# EAGLE design Driver3 (EAGLE 6.0)
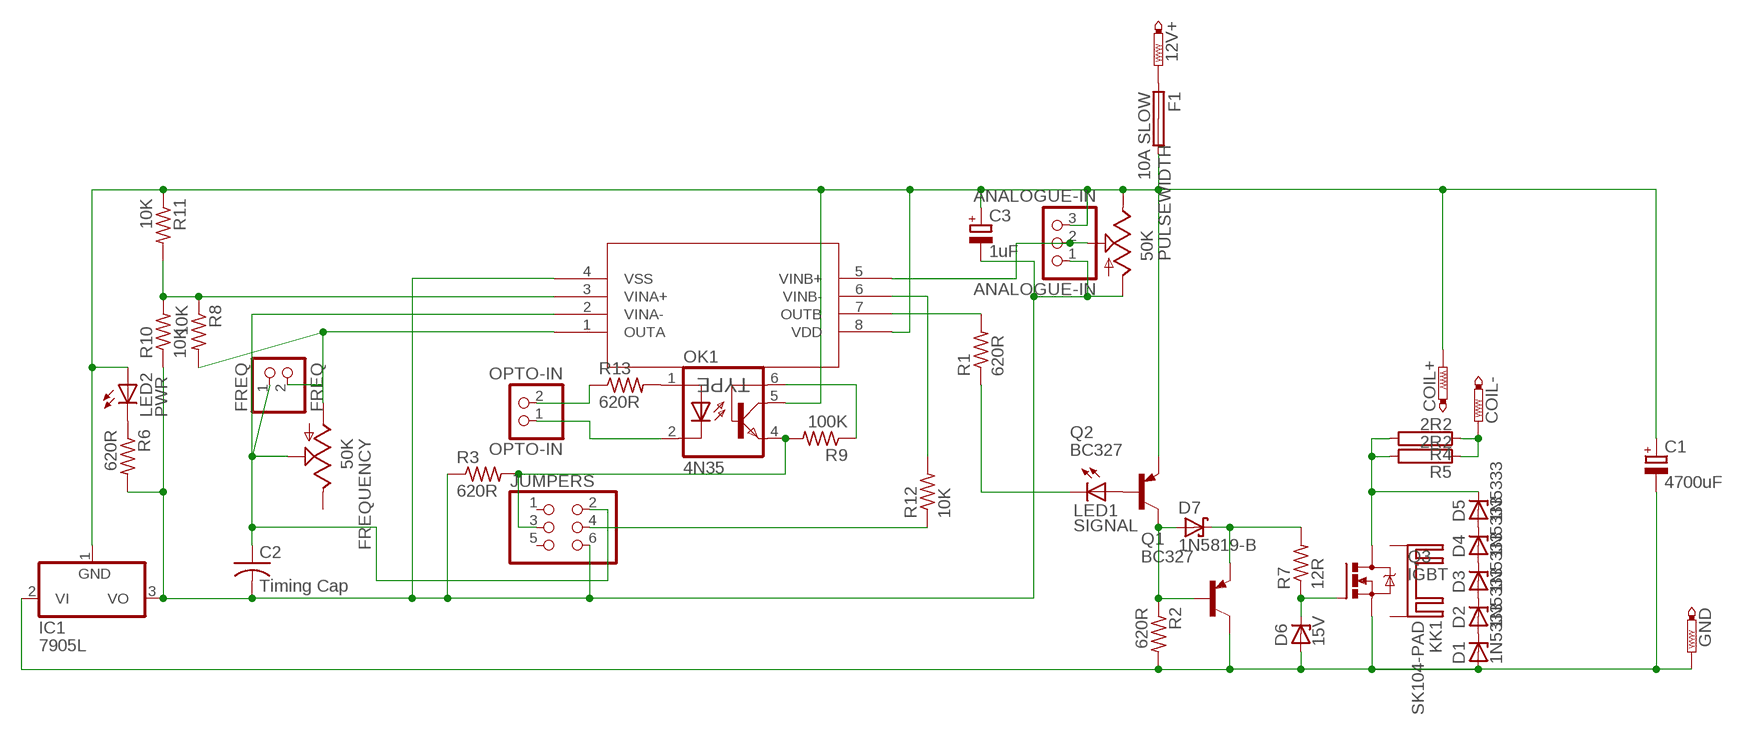
[diagram p0: schematic, sheet 1]

## Parts
12V+  PTR1PAD1-20Y  [P1-20Y]
ANALOGUE-IN  ANALOGUE-IN  PINHD-1X3  [1X03]
C1  4700uF  CPOL-EUE7.5-16  [E7,5-16]
C2  Timing Cap  C-US050-025X075  [C050-025X075]
C3  1uF  CPOL-EUE5-5  [E5-5]
COIL+  PTR1PAD1-20Y  [P1-20Y]
COIL-  PTR1PAD1-20Y  [P1-20Y]
D1  1N5333  [C1702-15]
D2  1N5333  [C1702-15]
D3  1N5333  [C1702-15]
D4  1N5333  [C1702-15]
D5  1N5333  [C1702-15]
D6  15V  BZV10  [DO34Z7]
D7  1N5819-B  [DO41-7.6]
F1  10A SLOW  SHK20L  [SHK20L]
FREQ  FREQ  PINHD-1X2  [1X02]
FREQUENCY  50K  TRIM_US-B25X  [B25X]
GND  PTR1PAD1-20Y  [P1-20Y]
IC1  7905L  [TO92]
JUMPERS  PINHD-2X3  [2X03]
KK1  SK104-PAD  [SK104-PAD]
LED1  SIGNAL  LED3MM  [LED3MM]
LED2  PWR  LED3MM  [LED3MM]
OK1  4N35  [DIL06]
OPTO-IN  OPTO-IN  PINHD-1X2  [1X02]
PULSEWIDTH  50K  TRIM_US-B25X  [B25X]
Q1  BC327  [TO92]
Q2  BC327  [TO92]
Q3  IGBT  IRF740  [TO220BV]
R1  620R  R-US_0204/7  [0204/7]
R2  620R  R-US_0204/7  [0204/7]
R3  620R  R-US_0204/7  [0204/7]
R4  2R2  RHPS947  [HPS947]
R5  2R2  RHPS947  [HPS947]
R6  620R  R-US_0204/7  [0204/7]
R7  12R  R-US_0204/7  [0204/7]
R8  10K  R-US_0204/7  [0204/7]
R9  100K  R-US_0204/7  [0204/7]
R10  10K  R-US_0204/7  [0204/7]
R11  10K  R-US_0204/7  [0204/7]
R12  10K  R-US_0204/7  [0204/7]
R13  620R  R-US_0204/7  [0204/7]
U$1  MCP6542-X/P  [PDIP8_300MC]

## Nets
N$1: D6.C Q3.G R7.1
N$2: COIL-.TP R4.1 R5.1
N$3: D7.A Q1.2(B) Q2.3(C) R2.1
N$4: ANALOGUE-IN.3 C1.+ C3.+ COIL+.TP F1.2A IC1.1(GND) LED2.A OK1.5(COL) PULSEWIDTH.E Q2.1(E) R11.1 U$1.8(VDD)
N$5: R8.1 R10.2 R11.2 U$1.3(VINA+)
N$6: D4.C D5.A
N$7: R1.2 U$1.7(OUTB)
N$8: C1.- D1.A D6.A GND.TP IC1.2(VI) Q1.3(C) Q3.S R2.2
N$9: ANALOGUE-IN.1 C2.2 C3.- IC1.3(VO) JUMPERS.6 PULSEWIDTH.A R3.1 R6.2 R10.1 U$1.4(VSS)
N$10: D1.C D2.A
N$11: D2.C D3.A
N$12: D3.C D4.A
N$13: D5.C Q3.D R4.2 R5.2
N$14: 12V+.TP F1.1A
N$15: LED1.A Q2.2(B)
N$16: ANALOGUE-IN.2 PULSEWIDTH.S U$1.5(VINB+)
N$17: LED2.K(C) R6.1
N$18: D7.C Q1.1(E) R7.2
N$19: R12.2 U$1.6(VINB-)
N$20: FREQ.2 FREQUENCY.A R8.2 U$1.1(OUTA)
N$21: C2.1 FREQ.1 FREQUENCY.S JUMPERS.2 U$1.2(VINA-)
N$22: JUMPERS.4 R12.1
N$23: JUMPERS.3 OK1.4(EMI) R3.2 R9.2
N$24: OK1.6(BAS) R9.1
N$25: OK1.1(A) R13.2
N$26: OK1.2(C) OPTO-IN.1
N$27: OPTO-IN.2 R13.1
N$29: LED1.K(C) R1.1
Unconnected: F1.1B F1.2B FREQUENCY.E JUMPERS.1 JUMPERS.5 KK1.K1(K) KK1.K2(K)

## Library data of the parts
12V+ COIL+ COIL- GND = testpad:PTR1: TEST PIN
ANALOGUE-IN = pinhead:PINHD-1X3: PIN HEADER
C1 C3 = rcl:CPOL-EU: POLARIZED CAPACITOR, European symbol
C2 = resistor:C-US: CAPACITOR, American symbol
D1-D5 = diode:1N5333: Z DIODE 3.3 V, 5W, 5 percent (Motorola)
D6 = diode:BZV10: Z DIODE
D7 = diode:1N581*: 1.0A SCHOTTKY BARRIER RECTIFIER Source: http://www.diodes.com/datasheets/ds23001.pdf
F1 = fuse:SHK20L: FUSE HOLDER 5 x 20 mm, SH contact, SHH1 Schukat, E1073 Buerklin; OC_FARNELL: unknown; OC_NEWARK: unknown
FREQ OPTO-IN = pinhead:PINHD-1X2: PIN HEADER
FREQUENCY PULSEWIDTH = pot:TRIM_US-: POTENTIOMETER
IC1 = linear:79*: Negative VOLTAGE REGULATOR
JUMPERS = pinhead:PINHD-2X3: PIN HEADER
KK1 = heatsink:SK104-PAD: HEATSINK manufacturer Fischer/distributor Buerklin
LED1 LED2 = led:LED: LED OSRAM: - CHIPLED LG R971, LG N971, LY N971, LG Q971, LY Q971, LO R971, LY R971 LH N974, LH R974 LS Q976, LO Q976, LY Q976 LO Q996 - Hyper CHIPLED LW Q18S LB Q993, LB Q99A, LB R99A - SideLED LS A670, LO A670, LY A670, LG A670, LP A670 LB A673, LV A673, LT A673, LW A673 LH A674 LY A675 LS A676, LA A676, LO A676, LY A676, LW A676 LS A679, LY A679, LG A679 - Hyper Micro SIDELED® LS Y876, LA Y876, LO Y876, LY Y876 LT Y87S - SmartLED LW L88C, LW L88S LB L89C, LB L89S, LG L890 LS L89K, LO L89K, LY L89K LS L896, LA L896, LO L896, LY L896 - TOPLED LS T670, LO T670, LY T670, LG T670, LP T670 LSG T670, LSP T670, LSY T670, LOP T670, LYG T670 LG T671, LOG T671, LSG T671 LB T673, LV T673, LT T673, LW T673 LH T674 LS T676, LA T676, LO T676, LY T676, LB T676, LH T676, LSB T676, LW T676 LB T67C, LV T67C, LT T67C, LS T67K, LO T67K, LY T67K, LW E67C LS E67B, LA E67B, LO E67B, LY E67B, LB E67C, LV E67C, LT E67C LW T67C LS T679, LY T679, LG T679 LS T770, LO T770, LY T770, LG T770, LP T770 LB T773, LV T773, LT T773, LW T773 LH T774 LS E675, LA E675, LY E675, LS T675 LS T776, LA T776, LO T776, LY T776, LB T776 LHGB T686 LT T68C, LB T68C - Hyper Mini TOPLED® LB M676 - Mini TOPLED Santana® LG M470 LS M47K, LO M47K, LY M47K Source: http://www.osram.convergy.de LUXEON: - LUMILED® LXK2-PW12-R00, LXK2-PW12-S00, LXK2-PW14-U00, LXK2-PW14-V00 LXK2-PM12-R00, LXK2-PM12-S00, LXK2-PM14-U00 LXK2-PE12-Q00, LXK2-PE12-R00, LXK2-PE12-S00, LXK2-PE14-T00, LXK2-PE14-U00 LXK2-PB12-K00, LXK2-PB12-L00, LXK2-PB12-M00, LXK2-PB14-N00, LXK2-PB14-P00, LXK2-PB14-Q00 LXK2-PR12-L00, LXK2-PR12-M00, LXK2-PR14-Q00, LXK2-PR14-R00 LXK2-PD12-Q00, LXK2-PD12-R00, LXK2-PD12-S00 LXK2-PH12-R00, LXK2-PH12-S00 LXK2-PL12-P00, LXK2-PL12-Q00, LXK2-PL12-R00 Source: www.luxeon.com KINGBRIGHT: KA-3528ASYC Source: www.kingbright.com
OK1 = optocoupler:4N35: MOTOROLA OPTO COUPLER; MF: FAIRCHILD SEMICONDUCTOR; MPN: 4N35; OC_FARNELL: 1328375; OC_NEWARK: 72K9946
Q1 Q2 = transistor-pnp:BC327: PNP Transistor
Q3 = transistor-power:IRF740: N-CHANNEL MOS FET
R1-R3 R8-R13 = resistor:R-US_: RESISTOR, American symbol
R4 R5 = resistor-power:R: Power Resitor; OC_FARNELL: unknown; OC_NEWARK: unknown
R6 R7 = rcl:R-US_: RESISTOR, American symbol
U$1 = mcp6542p:MCP6542-X/P

## Board
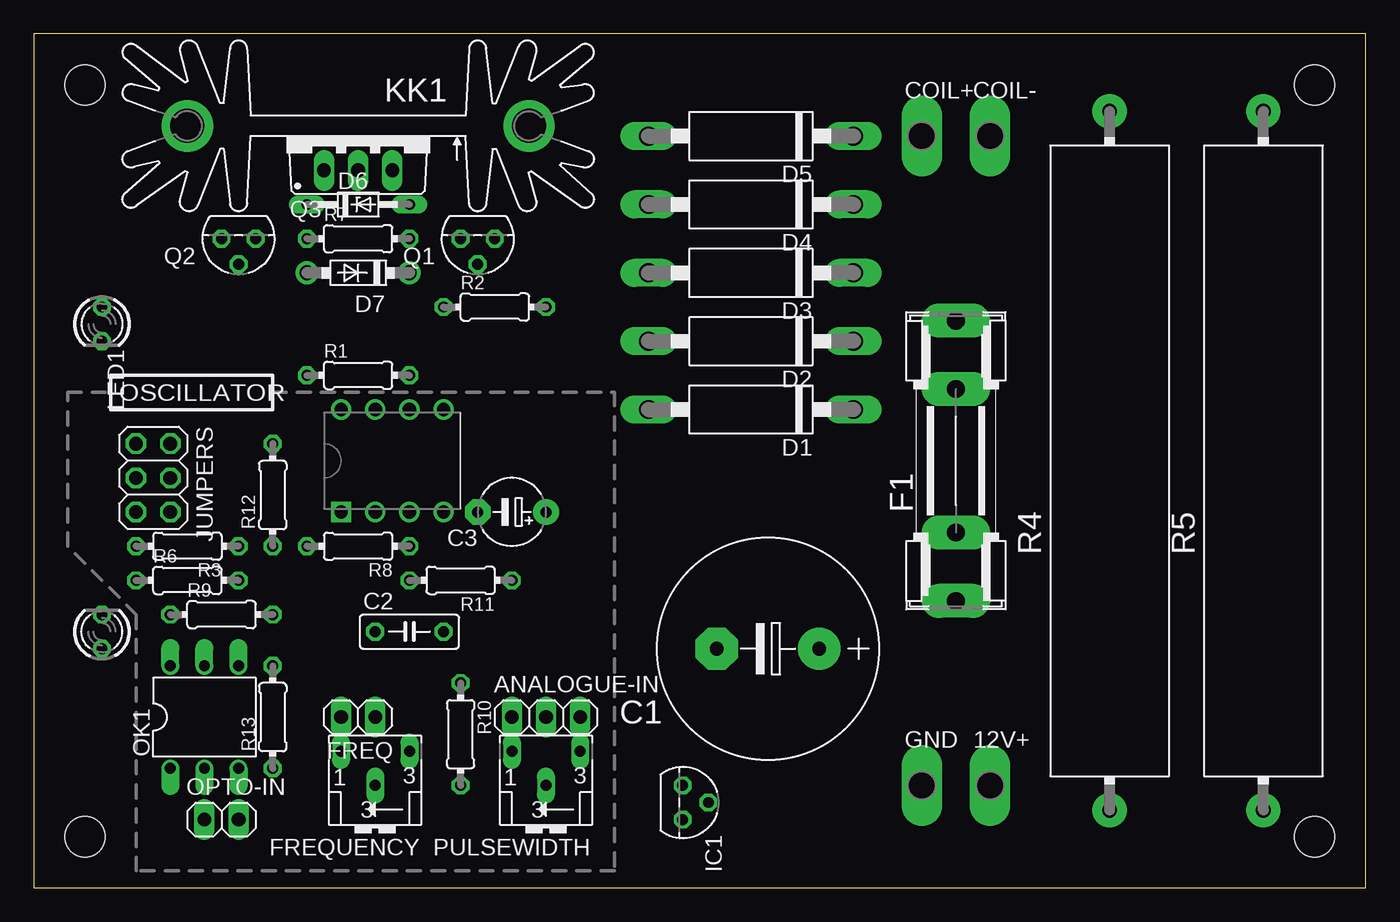
[diagram p1: board, top side]
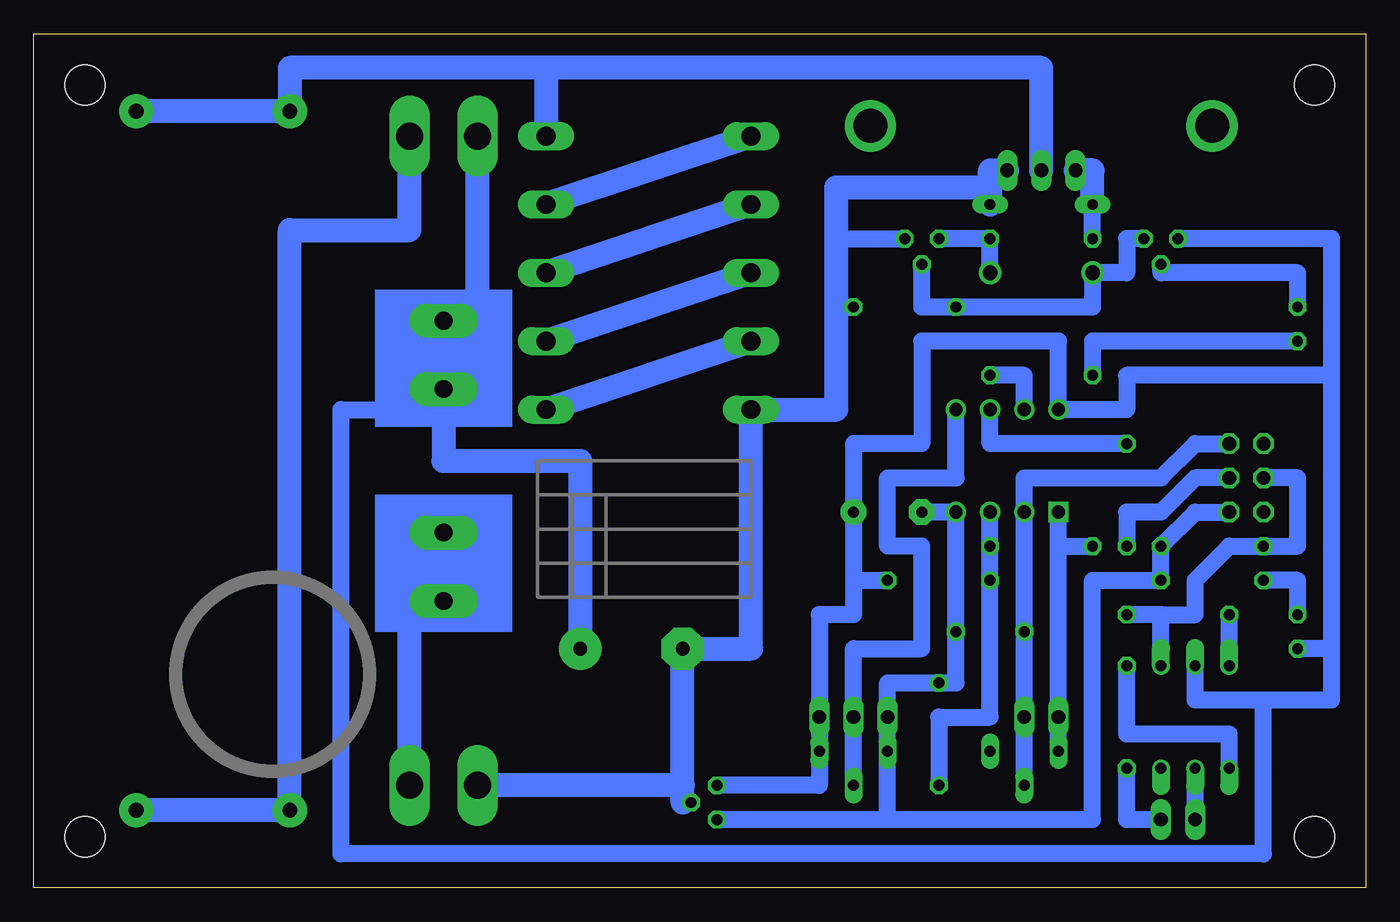
[diagram p2: board, bottom side, seen from below]

Size 99.06 x 63.5 mm. Coordinates in mm from the lower left corner, seen from the top.
Outline: 0,63.5 0,0 99.06,0 99.06,63.5 0,63.5
Copper layers (1*16): Top 0.035mm / dielectric 1.5mm / Bottom 0.035mm
Design rules: minimum track width 10mil, minimum drill 24mil, track to track 8mil, track to pad 8mil, pad to pad 8mil, via to via 8mil, smd to smd 8mil, copper to edge 40mil, drill to drill 8mil, minimum pad ring 10mil, minimum via ring 8mil, stop-mask expansion 4mil, vias tented up to drill 0mil, thermal gap 10mil
Holes 3 mm at 95.25,59.69 95.25,3.81 3.81,59.69 3.81,3.81

### Footprints (pad centres in the part's own frame; a part is rotated, then mirrored left to right if it is on the bottom)
P1-20Y = drill 2.007 pad 2.54 long: TP 0,0
1X03 = drill 1.016 long: 1 -2.54,0; 2 0,0; 3 2.54,0
E7,5-16 = drill 1.016 pad 3.15: + -3.81,0 | drill 1.016 pad 3.15 octagon: - 3.81,0
C050-025X075 = drill 0.813 octagon: 1 -2.54,0; 2 2.54,0
E5-5 = drill 0.813 pad 1.905: + -2.54,0 | drill 0.813 pad 1.905 octagon: - 2.54,0
C1702-15 = drill 1.397 long: A 7.62,0; C -7.62,0
DO34Z7 = drill 0.813 long: A 3.81,0; C -3.81,0
DO41-7.6 = drill 1.1 pad 1.7: A 3.81,0; C -3.81,0
SHK20L = drill 1.321 pad 2.54 long: 1A -10.414,0; 1B -5.334,0; 2A 10.414,0; 2B 5.334,0
1X02 = drill 1.016 long: 1 -1.27,0; 2 1.27,0
B25X = drill 0.813 long: A 2.54,-1.905; E -2.54,-1.905; S 0,0.635
TO92 = drill 0.813 octagon: 1 -1.27,0; 2 0,1.905; 3 1.27,0
2X03 = drill 1.016 octagon: 1 -2.54,-1.27; 2 -2.54,1.27; 3 0,-1.27; 4 0,1.27; 5 2.54,-1.27; 6 2.54,1.27
SK104-PAD = drill 2.54 pad 3.81: K1 -12.7,-0.762; K2 12.7,-0.762
LED3MM = drill 0.813 octagon: A -1.27,0; K 1.27,0
DIL06 = drill 0.813 offset: 1 -2.54,-3.81; 2 0,-3.81; 3 2.54,-3.81; 4 2.54,3.81; 5 0,3.81; 6 -2.54,3.81
TO92' = drill 0.813 octagon: 1 1.27,0; 2 0,1.905; 3 -1.27,0
TO220BV = drill 1.016 long: D 0,-2.54; G -2.54,-2.54; S 2.54,-2.54
0204/7 = drill 0.813 octagon: 1 -3.81,0; 2 3.81,0
HPS947 = drill 1.1 pad 2.54: 1 -25.97,0; 2 25.97,0
PDIP8_300MC = drill 0.991 square: 1 -7.62,7.62 | drill 0.991: 2 -7.62,5.08; 3 -7.62,2.54; 4 -7.62,0; 5 0,0; 6 0,2.54; 7 0,5.08; 8 0,7.62

### Placement (x,y rotation side)
12V+  71.12,7.62 0 top
ANALOGUE-IN  38.1,12.7 0 top
C1  54.61,17.78 180 top
C2  27.94,19.05 0 top
C3  35.56,27.94 180 top
COIL+  66.04,55.88 0 top
COIL-  71.12,55.88 0 top
D1  53.34,35.56 180 top
D2  53.34,40.64 180 top
D3  53.34,45.72 180 top
D4  53.34,50.8 180 top
D5  53.34,55.88 180 top
D6  24.13,50.8 0 top
D7  24.13,45.72 180 top
F1  68.58,31.75 90 top
FREQ  24.13,12.7 180 top
FREQUENCY  25.4,8.26 180 top
GND  66.04,7.62 0 top
IC1  48.26,6.35 270 top
JUMPERS  8.89,30.48 270 top
KK1  24.13,55.88 180 top
LED1  5.08,41.91 270 top
LED2  5.08,19.05 90 top
OK1  12.7,12.7 0 top
OPTO-IN  13.97,5.08 0 top
PULSEWIDTH  38.1,8.26 180 top
Q1  BC327  [TO92']  33.02,48.26 180 top
Q2  BC327  [TO92']  15.24,48.26 180 top
Q3  24.13,55.88 0 top
R1  24.13,38.1 0 top
R2  34.29,43.18 0 top
R3  11.43,25.4 180 top
R4  80.01,31.75 90 top
R5  91.44,31.75 90 top
R6  11.43,22.86 0 top
R7  24.13,48.26 0 top
R8  24.13,25.4 180 top
R9  13.97,20.32 0 top
R10  31.75,11.43 270 top
R11  31.75,22.86 180 top
R12  17.78,29.21 90 top
R13  17.78,12.7 90 top
U$1  30.48,35.56 90 top

### Tracks (layer width: path | path; a pad name or v marks a point on that pad's centre or on a via)
N$1
  Bottom 1.27: R7.1 D6.C
  Bottom 1.778: Q3.G 20.32,53.34 D6.C
N$2
  Bottom 1.778: COIL-.TP 71.12,48.9 80.01,48.9 R4.1 R5.1
N$3
  Bottom 1.27: Q2.3 17.78,48.26 17.78,45.72 D7.A 20.32,43.18 R2.1 33.02,43.18 Q1.2
N$4
  Bottom 1.27: Q2.1 2.54,48.26 2.54,38.1 | 2.54,17.78 2.54,13.97 7.62,13.97 | F1.2A 68.58,35.56 76.2,35.56 76.2,2.54 7.62,2.54 7.62,13.97 | 38.1,22.86 R11.1 | 38.1,22.86 C3.+ 38.1,33.02 33.02,33.02 33.02,40.64 22.86,40.64 U$1.8 17.78,35.56 17.78,38.1 2.54,38.1 | 38.1,22.86 38.1,20.32 40.64,20.32 ANALOGUE-IN.3 PULSEWIDTH.E 40.64,7.62 IC1.1 | 2.54,17.78 2.54,38.1 | OK1.5 12.7,13.97 7.62,13.97 | 2.54,17.78 LED2.A
  Bottom 1.778: 66.23,39.81 66.04,39.81 66.04,41.91 | 66.04,41.91 COIL+.TP | C1.+ 58.42,31.75 68.58,31.75 F1.2A 67.94,42.16 67.94,41.91 66.04,41.91
N$5
  Bottom 1.27: U$1.3 R8.1 R11.2 27.94,12.7 31.75,12.7 R10.2
N$6
  Bottom 1.778: D5.A D4.C
N$7
  Bottom 1.27: U$1.7 25.4,38.1 R1.2
N$8
  Bottom 1.27: 39.37,48.26 Q1.3 | 39.37,43.18 R2.2 | IC1.2 50.8,6.35
  Bottom 1.778: 50.8,6.35 50.8,7.62 | 50.8,7.62 C1.- 45.72,17.78 D1.A 39.37,35.56 39.37,43.18 39.37,48.26 39.37,52.07 27.94,52.07 | 50.8,7.62 GND.TP | 27.94,52.07 D6.A | 27.94,52.07 27.94,53.34 Q3.S
N$9
  Bottom 1.27: C3.- U$1.4 C2.2 30.48,15.24 R10.1 35.56,15.24 ANALOGUE-IN.1 PULSEWIDTH.A 35.56,5.08 | 35.56,5.08 IC1.3 | JUMPERS.6 12.7,27.94 R3.1 R6.2 20.32,22.86 20.32,5.08 35.56,5.08
N$10
  Bottom 1.778: D2.A D1.C
N$11
  Bottom 1.778: D3.A D2.C
N$12
  Bottom 1.778: D4.A D3.C
N$13
  Bottom 1.778: Q3.D 24.13,60.96 60.96,60.96 | 60.96,60.96 D5.C | 60.96,60.96 80.01,60.96 R4.2 R5.2
N$14
  Bottom 1.778: 12V+.TP 71.12,21.34 F1.1A
N$15
  Bottom 1.27: LED1.A 5.08,45.72 15.24,45.72 Q2.2
N$16
  Bottom 1.27: U$1.5 30.48,30.48 35.56,30.48 35.56,25.4 33.02,25.4 33.02,17.78 38.1,17.78 ANALOGUE-IN.2 PULSEWIDTH.S
N$17
  Bottom 1.27: LED2.K 5.08,22.86 R6.1
N$18
  Bottom 1.27: D7.C R7.2 Q1.1
N$19
  Bottom 1.27: R12.2 27.94,33.02 U$1.6
N$20
  Bottom 1.27: 22.86,25.4 U$1.1 | 22.86,25.4 R8.2 | 22.86,25.4 FREQ.2 FREQUENCY.A
N$21
  Bottom 1.27: FREQUENCY.S FREQ.1 C2.1 U$1.2 25.4,30.48 15.24,30.48 12.7,33.02 JUMPERS.2
N$22
  Bottom 1.27: JUMPERS.4 12.7,30.48 15.24,27.94 17.78,27.94 R12.1
N$23
  Bottom 1.27: JUMPERS.3 5.08,30.48 5.08,25.4 R3.2 10.16,25.4 12.7,22.86 12.7,20.32 15.24,20.32 | 15.24,20.32 R9.2 | OK1.4 15.24,20.32
N$24
  Bottom 1.27: OK1.6 R9.1
N$25
  Bottom 1.27: R13.2 17.78,11.43 10.16,11.43 OK1.1
N$26
  Bottom 1.27: OPTO-IN.1 OK1.2
N$27
  Bottom 1.27: OPTO-IN.2 17.78,5.08 R13.1
N$29
  Bottom 1.27: LED1.K 20.32,40.64 R1.1
(copper drawn outside any net)
  shapes: Bottom area x2

### Text on the board
tPlace: OSCILLATOR
tValues: Frequency | PWM
tDocu: COIL + | COIL - | C | MCP6542 | D | A | B | GND | +12V | +7v | Threshold | +12v | + | -
bDocu: Licensed under the TAPR NCL | www.tapr.org/NCL | http://artifactory.org.au/kits/coildriver | Copyright 2011 | Brett Downing | brett@artifactory.org.au | Mode Pin Ref | Daniel Harmsworth | [J] Opto En | D | A | atrophy@artifactory.org.au | [J] Int Osc | C | A | Ext Osc In | B | A | Coil Driver V2.0 | www.artifactory.org.au